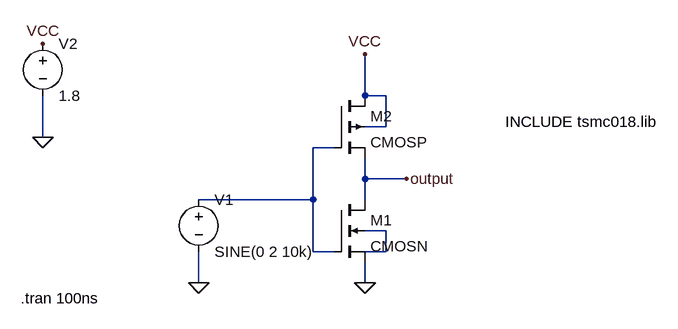
[diagram p0: schematic Draft3.asc]
Draft3.asc, the LTspice schematic file:
Version 4
SHEET 1 880 680
WIRE 96 48 96 -16
WIRE 128 48 96 48
WIRE 128 96 128 48
WIRE 128 96 96 96
WIRE -400 112 -400 48
WIRE 48 128 16 128
WIRE 96 176 96 144
WIRE 160 176 96 176
WIRE 16 208 16 128
WIRE 16 208 -160 208
WIRE 96 208 96 176
WIRE 128 256 96 256
WIRE 16 288 16 208
WIRE 48 288 16 288
WIRE 128 288 128 256
WIRE 128 288 96 288
WIRE -160 336 -160 288
WIRE 96 336 96 304
FLAG 96 336 0
FLAG 96 -16 VCC
FLAG 160 176 output
FLAG -160 336 0
FLAG -400 -32 VCC
FLAG -400 112 0
SYMBOL cmosn 48 208 R0
SYMATTR InstName M1
SYMBOL cmosp 48 48 R0
SYMATTR InstName M2
SYMBOL voltage -160 192 R0
WINDOW 123 0 0 Left 0
WINDOW 39 0 0 Left 0
SYMATTR InstName V1
SYMATTR Value SINE(0 2 10k)
SYMBOL voltage -400 -48 R0
WINDOW 123 0 0 Left 0
WINDOW 39 0 0 Left 0
SYMATTR InstName V2
SYMATTR Value 1.8
TEXT 312 88 Left 2 !INCLUDE tsmc018.lib
TEXT -434 360 Left 2 !.tran 100ns

The netlist it stands for:
* Draft3.asc
M1 output N001 0 N002 CMOSN
M2 VCC N001 output VCC CMOSP
V1 N001 0 SINE(0 2 10k)
V2 VCC 0 1.8
.model NMOS NMOS
.model PMOS PMOS
.lib standard.mos
INCLUDE tsmc018.lib
.tran 100ns
.backanno
.end